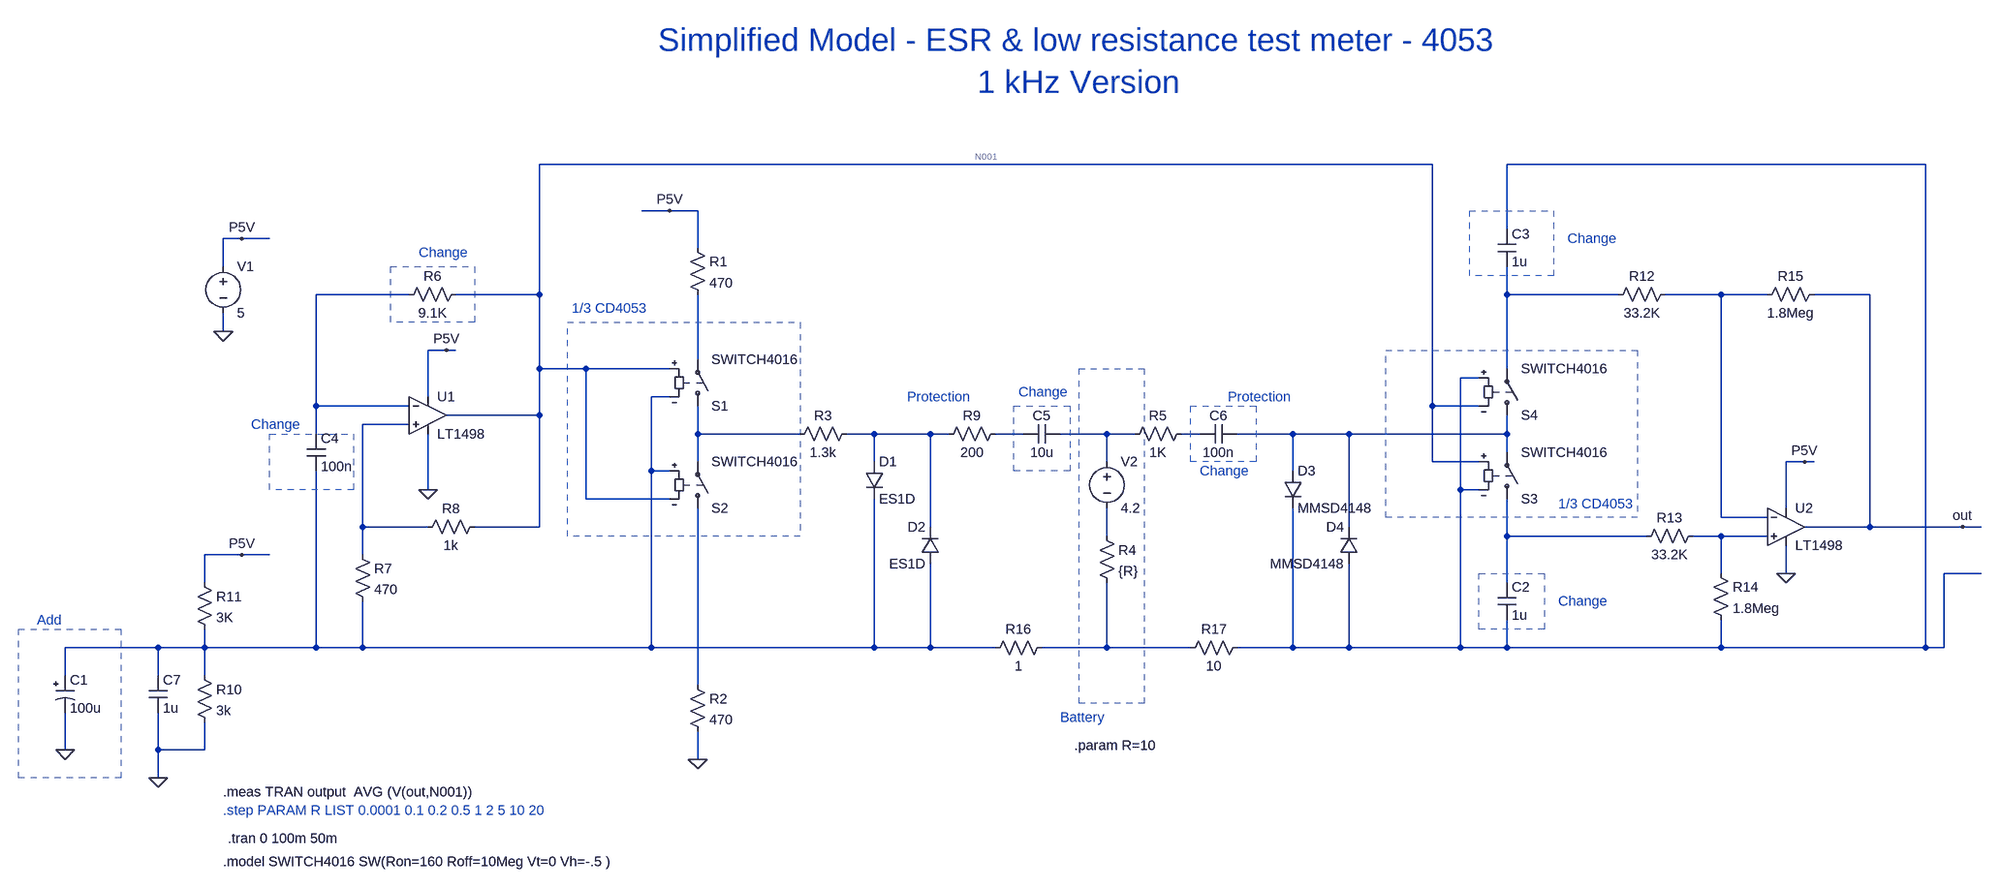
[diagram p0: schematic 4053 esr meter 1KHz.asc]
4053 esr meter 1KHz.asc, the LTspice schematic file:
Version 4
SHEET 1 3028 832
WIRE 1632 -384 96 -384
WIRE 2480 -384 1760 -384
WIRE 320 -304 272 -304
WIRE 368 -304 320 -304
WIRE 1760 -272 1760 -384
WIRE -416 -256 -448 -256
WIRE -368 -256 -416 -256
WIRE 368 -240 368 -304
WIRE -448 -208 -448 -256
WIRE -128 -160 -288 -160
WIRE 96 -160 96 -384
WIRE 96 -160 -48 -160
WIRE 1760 -160 1760 -208
WIRE 1952 -160 1760 -160
WIRE 2128 -160 2032 -160
WIRE 2208 -160 2128 -160
WIRE 2384 -160 2288 -160
WIRE -448 -96 -448 -128
WIRE -64 -64 -96 -64
WIRE -48 -64 -64 -64
WIRE 368 -48 368 -160
WIRE 96 -32 96 -160
WIRE 176 -32 96 -32
WIRE 320 -32 176 -32
WIRE 1760 -32 1760 -160
WIRE 1712 -16 1680 -16
WIRE -96 16 -96 -64
WIRE 320 16 288 16
WIRE -288 32 -288 -160
WIRE -128 32 -288 32
WIRE 1632 32 1632 -384
WIRE 1712 32 1632 32
WIRE 96 48 96 -32
WIRE 96 48 -64 48
WIRE -128 64 -208 64
WIRE -288 80 -288 32
WIRE 368 80 368 32
WIRE 544 80 368 80
WIRE 672 80 624 80
WIRE 768 80 672 80
WIRE 800 80 768 80
WIRE 928 80 880 80
WIRE 1072 80 992 80
WIRE 1120 80 1072 80
WIRE 1232 80 1200 80
WIRE 1392 80 1296 80
WIRE 1488 80 1392 80
WIRE 1760 80 1760 48
WIRE 1760 80 1488 80
WIRE 1760 112 1760 80
WIRE 368 128 368 80
WIRE 672 128 672 80
WIRE 1072 128 1072 80
WIRE 1632 128 1632 32
WIRE 1712 128 1632 128
WIRE 2272 128 2240 128
WIRE 2288 128 2272 128
WIRE 288 144 288 16
WIRE 320 144 288 144
WIRE 1392 144 1392 80
WIRE -96 176 -96 80
WIRE 1680 176 1680 -16
WIRE 1712 176 1680 176
WIRE 176 192 176 -32
WIRE 320 192 176 192
WIRE 2240 208 2240 128
WIRE 2128 224 2128 -160
WIRE 2208 224 2128 224
WIRE -208 240 -208 64
WIRE -96 240 -208 240
WIRE 96 240 96 48
WIRE 96 240 -16 240
WIRE 768 240 768 80
WIRE 1488 240 1488 80
WIRE 2384 240 2384 -160
WIRE 2384 240 2272 240
WIRE 2544 240 2384 240
WIRE 2576 240 2544 240
WIRE 1072 256 1072 208
WIRE 1760 256 1760 192
WIRE 2000 256 1760 256
WIRE 2128 256 2080 256
WIRE 2208 256 2128 256
WIRE -416 288 -480 288
WIRE -368 288 -416 288
WIRE -208 288 -208 240
WIRE 2128 320 2128 256
WIRE 2240 320 2240 272
WIRE 2576 320 2512 320
WIRE -480 336 -480 288
WIRE 1760 336 1760 256
WIRE -560 448 -720 448
WIRE -480 448 -480 416
WIRE -480 448 -560 448
WIRE -288 448 -288 144
WIRE -288 448 -480 448
WIRE -208 448 -208 368
WIRE -208 448 -288 448
WIRE 288 448 288 144
WIRE 288 448 -208 448
WIRE 672 448 672 192
WIRE 672 448 288 448
WIRE 768 448 768 304
WIRE 768 448 672 448
WIRE 880 448 768 448
WIRE 1072 448 1072 336
WIRE 1072 448 960 448
WIRE 1216 448 1072 448
WIRE 1392 448 1392 208
WIRE 1392 448 1296 448
WIRE 1488 448 1488 304
WIRE 1488 448 1392 448
WIRE 1680 448 1680 176
WIRE 1680 448 1488 448
WIRE 1760 448 1760 400
WIRE 1760 448 1680 448
WIRE 2128 448 2128 400
WIRE 2128 448 1760 448
WIRE 2480 448 2480 -384
WIRE 2480 448 2128 448
WIRE 2512 448 2512 320
WIRE 2512 448 2480 448
WIRE -720 496 -720 448
WIRE -560 496 -560 448
WIRE -480 496 -480 448
WIRE 368 512 368 208
WIRE -720 624 -720 560
WIRE -560 624 -560 560
WIRE -480 624 -480 576
WIRE -480 624 -560 624
WIRE 368 640 368 592
WIRE -560 672 -560 624
FLAG -448 -96 0
FLAG -416 -256 P5V
FLAG 320 -304 P5V
FLAG 2544 240 out
FLAG -64 -64 P5V
FLAG -416 288 P5V
FLAG 368 640 0
FLAG -560 672 0
FLAG -96 176 0
FLAG 2272 128 P5V
FLAG 2240 320 0
FLAG -720 624 0
SYMBOL voltage -448 -224 R0
WINDOW 123 0 0 Left 2
WINDOW 39 0 0 Left 2
SYMATTR InstName V1
SYMATTR Value 5
SYMBOL sw 368 48 M180
SYMATTR InstName S1
SYMATTR Value SWITCH4016
SYMBOL sw 368 224 M180
SYMATTR InstName S2
SYMATTR Value SWITCH4016
SYMBOL res 352 -256 R0
SYMATTR InstName R1
SYMATTR Value 470
SYMBOL res 352 496 R0
SYMATTR InstName R2
SYMATTR Value 470
SYMBOL res 640 64 R90
WINDOW 0 0 56 VBottom 2
WINDOW 3 32 56 VTop 2
SYMATTR InstName R3
SYMATTR Value 1.3k
SYMBOL res 1056 240 R0
SYMATTR InstName R4
SYMATTR Value {R}
SYMBOL res 1216 64 R90
WINDOW 0 0 56 VBottom 2
WINDOW 3 32 56 VTop 2
SYMATTR InstName R5
SYMATTR Value 1K
SYMBOL sw 1760 208 M180
SYMATTR InstName S3
SYMATTR Value SWITCH4016
SYMBOL sw 1760 64 M180
SYMATTR InstName S4
SYMATTR Value SWITCH4016
SYMBOL cap 1744 336 R0
SYMATTR InstName C2
SYMATTR Value 1u
SYMBOL cap 1744 -272 R0
SYMATTR InstName C3
SYMATTR Value 1u
SYMBOL cap -304 80 R0
SYMATTR InstName C4
SYMATTR Value 100n
SYMBOL res -32 -176 R90
WINDOW 0 0 56 VBottom 2
WINDOW 3 32 56 VTop 2
SYMATTR InstName R6
SYMATTR Value 9.1K
SYMBOL res -224 272 R0
SYMATTR InstName R7
SYMATTR Value 470
SYMBOL res 0 224 R90
WINDOW 0 0 56 VBottom 2
WINDOW 3 32 56 VTop 2
SYMATTR InstName R8
SYMATTR Value 1k
SYMBOL diode 656 128 R0
SYMATTR InstName D1
SYMATTR Value ES1D
SYMBOL diode 784 304 R180
WINDOW 0 24 64 Left 2
WINDOW 3 24 0 Left 2
SYMATTR InstName D2
SYMATTR Value ES1D
SYMBOL res 896 64 R90
WINDOW 0 0 56 VBottom 2
WINDOW 3 32 56 VTop 2
SYMATTR InstName R9
SYMATTR Value 200
SYMBOL cap 992 64 R90
WINDOW 0 0 32 VBottom 2
WINDOW 3 32 32 VTop 2
SYMATTR InstName C5
SYMATTR Value 10u
SYMBOL cap 1296 64 R90
WINDOW 0 0 32 VBottom 2
WINDOW 3 32 32 VTop 2
SYMATTR InstName C6
SYMATTR Value 100n
SYMBOL diode 1376 144 R0
SYMATTR InstName D3
SYMATTR Value MMSD4148
SYMBOL diode 1504 304 R180
WINDOW 0 24 64 Left 2
WINDOW 3 24 0 Left 2
SYMATTR InstName D4
SYMATTR Value MMSD4148
SYMBOL res -496 480 R0
SYMATTR InstName R10
SYMATTR Value 3k
SYMBOL res -496 320 R0
SYMATTR InstName R11
SYMATTR Value 3K
SYMBOL res 2048 -176 R90
WINDOW 0 0 56 VBottom 2
WINDOW 3 32 56 VTop 2
SYMATTR InstName R12
SYMATTR Value 33.2K
SYMBOL res 2096 240 R90
WINDOW 0 0 56 VBottom 2
WINDOW 3 32 56 VTop 2
SYMATTR InstName R13
SYMATTR Value 33.2K
SYMBOL res 2112 304 R0
SYMATTR InstName R14
SYMATTR Value 1.8Meg
SYMBOL res 2304 -176 R90
WINDOW 0 0 56 VBottom 2
WINDOW 3 32 56 VTop 2
SYMATTR InstName R15
SYMATTR Value 1.8Meg
SYMBOL Opamps\\LT1498 -96 -16 R0
SYMATTR InstName U1
SYMBOL Opamps\\LT1498 2240 176 R0
SYMATTR InstName U2
SYMBOL res 976 432 R90
WINDOW 0 0 56 VBottom 2
WINDOW 3 32 56 VTop 2
SYMATTR InstName R16
SYMATTR Value 1
SYMBOL res 1312 432 R90
WINDOW 0 0 56 VBottom 2
WINDOW 3 32 56 VTop 2
SYMATTR InstName R17
SYMATTR Value 10
SYMBOL voltage 1072 112 R0
WINDOW 123 0 0 Left 0
WINDOW 39 0 0 Left 0
SYMATTR InstName V2
SYMATTR Value 4.2
SYMBOL polcap -736 496 R0
WINDOW 3 24 56 Left 2
SYMATTR Value 100u
SYMATTR InstName C1
SYMATTR Description Capacitor
SYMATTR Type cap
SYMATTR SpiceLine V=6.3 Irms=150m Rser=0.85 Lser=0 mfg="Nichicon" pn="UPL0J101MAH" type="Al electrolytic"
SYMBOL cap -576 496 R0
SYMATTR InstName C7
SYMATTR Value 1u
TEXT -448 816 Left 2 !.model SWITCH4016 SW(Ron=160 Roff=10Meg Vt=0 Vh=-.5 )
TEXT -440 776 Left 2 !.tran 0 100m 50m
TEXT -448 728 Left 2 ;.step PARAM R LIST 0.0001 0.1 0.2 0.5 1 2 5 10 20
TEXT -448 696 Left 2 !.meas TRAN output  AVG (V(out,N001))
TEXT 1024 -592 Center 5 ;Simplified Model - ESR & low resistance test meter - 4053\n1 kHz Version
TEXT 992 568 Left 2 ;Battery
TEXT 152 -136 Left 2 ;1/3 CD4053
TEXT 1848 200 Left 2 ;1/3 CD4053
TEXT 728 16 Left 2 ;Protection
TEXT 1280 16 Left 2 ;Protection
TEXT 1016 616 Left 2 !.param R=10
TEXT -768 400 Left 2 ;Add
TEXT -400 64 Left 2 ;Change
TEXT -112 -232 Left 2 ;Change
TEXT 920 8 Left 2 ;Change
TEXT 1232 144 Left 2 ;Change
TEXT 1848 368 Left 2 ;Change
TEXT 1864 -256 Left 2 ;Change
RECTANGLE Normal 1136 544 1024 -32 2
RECTANGLE Normal 544 256 144 -112 2
RECTANGLE Normal 1984 224 1552 -64 2
RECTANGLE Normal -16 -112 -160 -208 2
RECTANGLE Normal -224 176 -368 80 2
RECTANGLE Normal 1008 144 912 32 2
RECTANGLE Normal 1328 128 1216 32 2
RECTANGLE Normal 1840 -192 1696 -304 2
RECTANGLE Normal 1824 416 1712 320 2
RECTANGLE Normal -624 672 -800 416 2

The netlist it stands for:
* 4053 esr meter 1KHz.asc
V1 P5V 0 5
S1 N009 N006 N001 N007 SWITCH4016
S2 N019 N009 N007 N001 SWITCH4016
R1 P5V N006 470
R2 N019 0 470
R3 N010 N009 1.3k
R4 N015 N018 {R}
R5 N013 N012 1K
S3 N016 N014 N001 N002 SWITCH4016
S4 N014 N004 N002 N001 SWITCH4016
C2 N016 N002 1u
C3 N002 N004 1u
C4 N003 N007 100n
R6 N001 N003 9.1K
R7 N008 N007 470
R8 N001 N008 1k
D1 N010 N007 ES1D
D2 N007 N010 ES1D
R9 N011 N010 200
C5 N012 N011 10u
C6 N014 N013 100n
D3 N014 N002 MMSD4148
D4 N002 N014 MMSD4148
R10 N007 0 3k
R11 P5V N007 3K
R12 N005 N004 33.2K
R13 N017 N016 33.2K
R14 N017 N002 1.8Meg
R15 out N005 1.8Meg
XU1 N008 N003 P5V 0 N001 LT1498  ; pins In+ In- V+ V- OUT
XU2 N017 N005 P5V 0 out LT1498  ; pins In+ In- V+ V- OUT
R16 N018 N007 1
R17 N002 N018 10
V2 N012 N015 4.2
C1 N007 0 100u V=6.3 Irms=150m Rser=0.85 Lser=0 mfg="Nichicon" pn="UPL0J101MAH" type="Al electrolytic"
C7 N007 0 1u
.model D D
.lib standard.dio
.model SWITCH4016 SW(Ron=160 Roff=10Meg Vt=0 Vh=-.5 )
.tran 0 100m 50m
* .step PARAM R LIST 0.0001 0.1 0.2 0.5 1 2 5 10 20
.meas TRAN output  AVG (V(out,N001))
* Simplified Model - ESR & low resistance test meter - 4053
* 1 kHz Version
* Battery
* 1/3 CD4053
* 1/3 CD4053
* Protection
* Protection
.param R=10
* Add
* Change
* Change
* Change
* Change
* Change
* Change
.lib LTC.lib
.backanno
.end